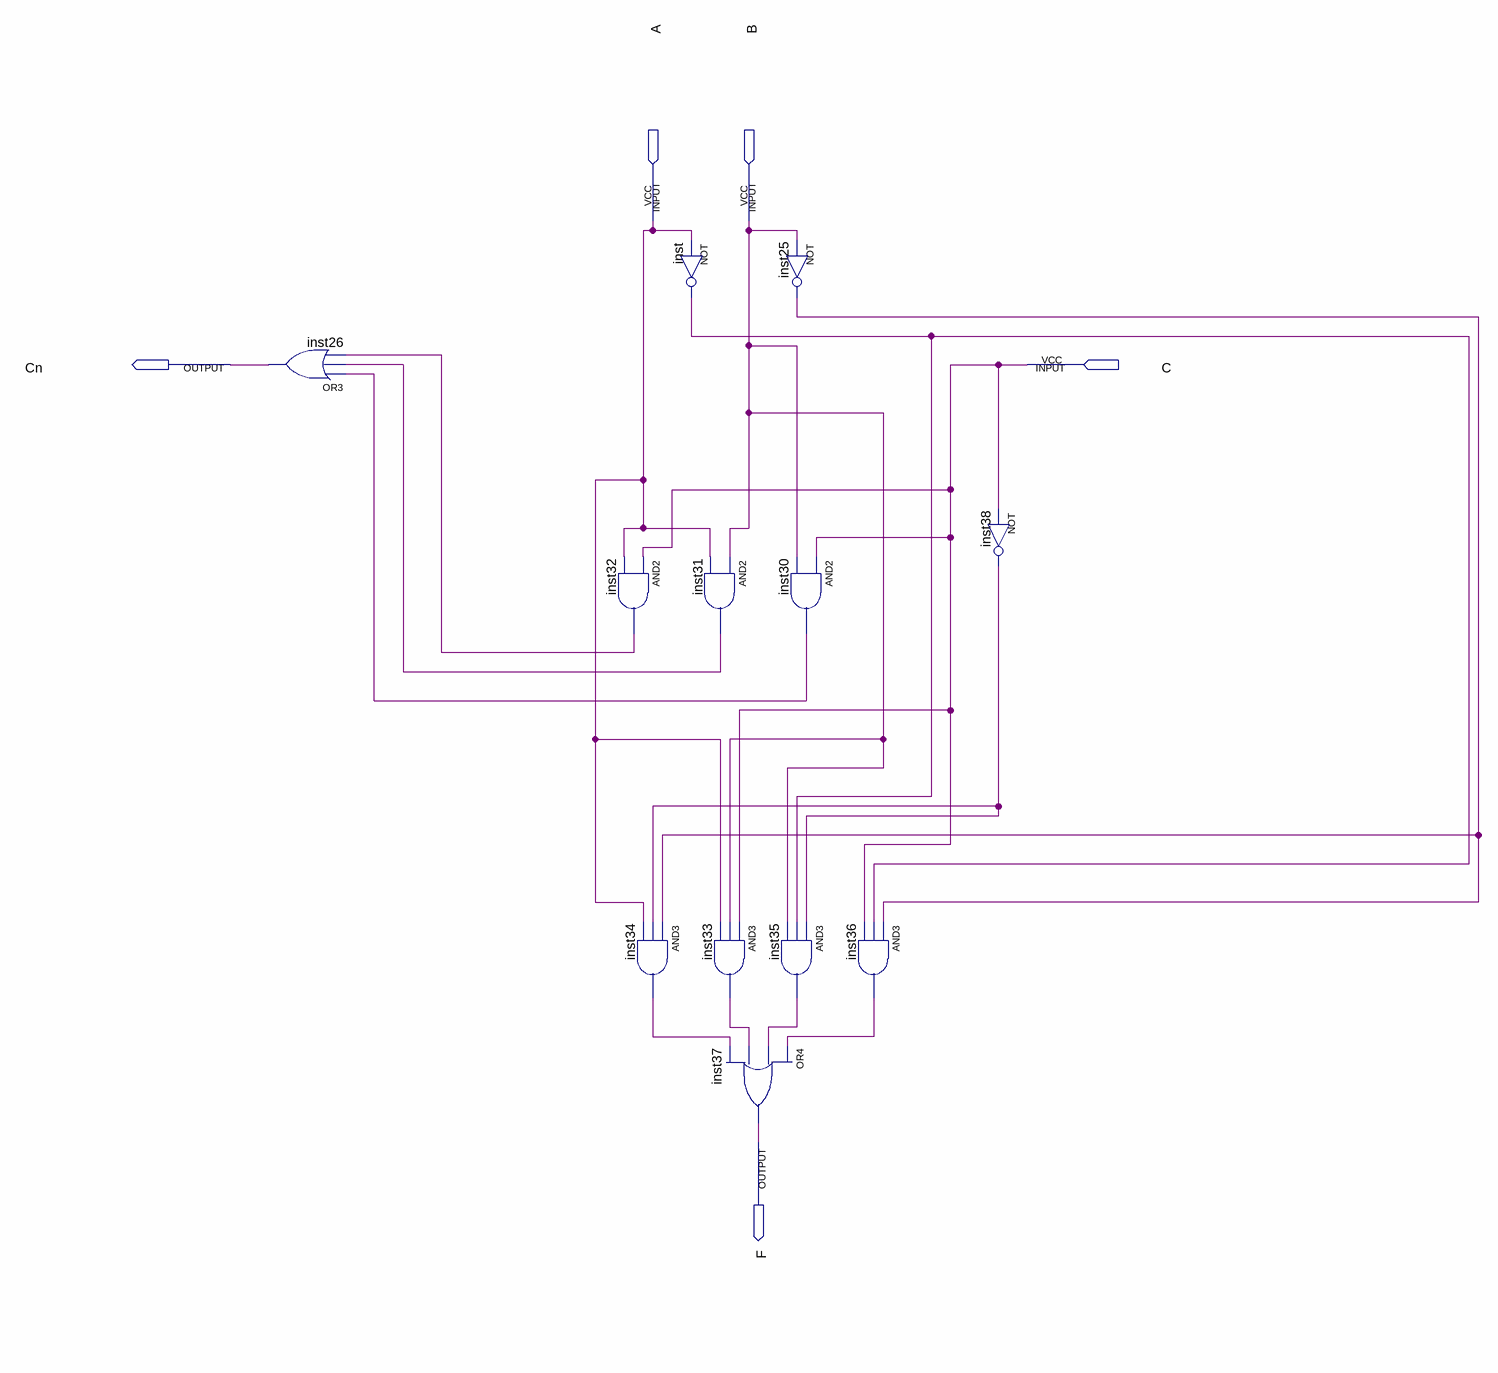
[diagram p0: schematic sheet]
// Quartus schematic Block3.bdf as structural Verilog: 12 symbols, 5 pins
module Block3 (
  input  A,
  input  B,
  input  C,
  output Cn,
  output F
);

  wire inst25_out, inst30_out, inst31_out, inst32_out, inst33_out, inst34_out, inst35_out, inst36_out,
       inst38_out, inst_out;

  or inst26 (Cn, inst30_out, inst31_out, inst32_out);
  and inst32 (inst32_out, C, A);
  and inst34 (inst34_out, inst25_out, inst38_out, A);
  not inst (inst_out, A);
  and inst31 (inst31_out, B, A);
  and inst33 (inst33_out, C, B, A);
  or inst37 (F, inst36_out, inst35_out, inst33_out, inst34_out);
  not inst25 (inst25_out, B);
  and inst30 (inst30_out, C, B);
  and inst35 (inst35_out, inst38_out, inst_out, B);
  and inst36 (inst36_out, inst25_out, inst_out, C);
  not inst38 (inst38_out, C);
endmodule
